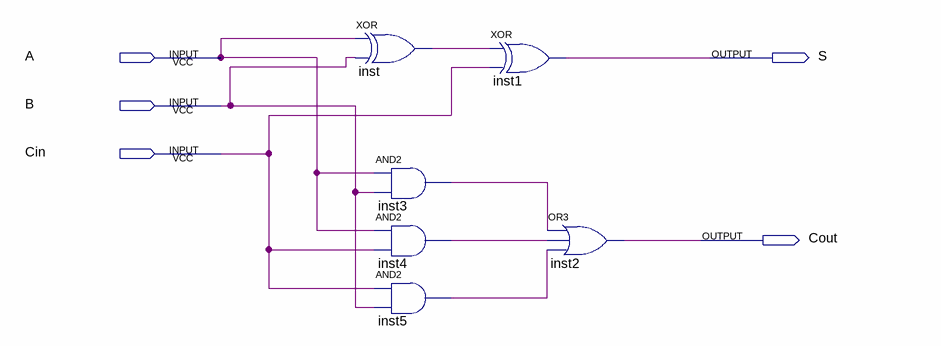
[diagram p0: schematic sheet]
// Quartus schematic FA.bdf as structural Verilog: 6 symbols, 5 pins
module FA (
  input  A,
  input  B,
  input  Cin,
  output S,
  output Cout
);

  wire inst3_out, inst4_out, inst5_out, inst_out;

  xor inst (inst_out, A, B);
  and inst3 (inst3_out, A, B);
  and inst4 (inst4_out, A, Cin);
  and inst5 (inst5_out, Cin, B);
  xor inst1 (S, inst_out, Cin);
  or inst2 (Cout, inst3_out, inst4_out, inst5_out);
endmodule
